# EAGLE design atxflip (EAGLE 7.2.0)
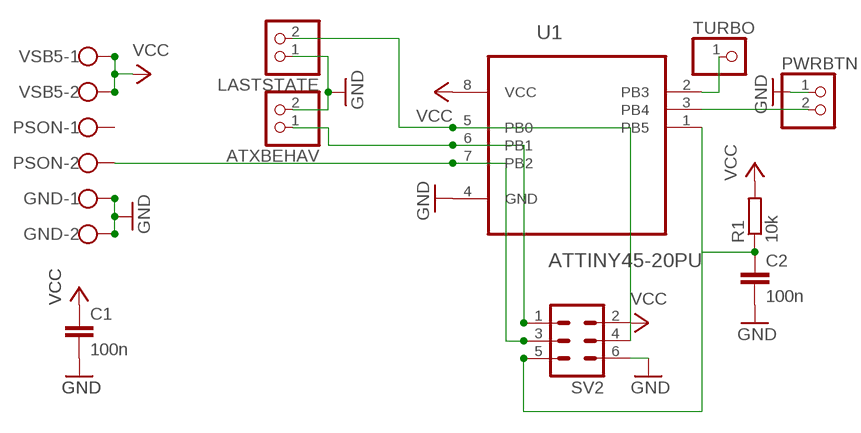
[diagram p0: schematic, sheet 1]

## Parts
ATXBEHAV  PINHD-1X2  [1X02]
C1  100n  C7.5/3  [C7.5B3]
C2  100n  C7.5/3  [C7.5B3]
GND  W237-102  [W237-102]
LASTSTATE  PINHD-1X2  [1X02]
PSON  W237-102  [W237-102]
PWRBTN  PINHD-1X2  [1X02]
R1  10k  R-EU_0207/10  [0207/10]
SV2  ML6  [ML6]
TURBO  PINHD-1X1  [1X01]
U1  ATTINY45-20PU  [DIP254P762X533-8]
VSB5  W237-102  [W237-102]

## Nets
GND: ATXBEHAV.2 C1.2 C2.2 GND.1 GND.2 LASTSTATE.1 PWRBTN.1 SV2.6 U1.4(GND)
N$1: PWRBTN.2 U1.3(PB4)
N$2: PSON.2 SV2.3 U1.7(PB2)
N$3: ATXBEHAV.1 SV2.1 U1.6(PB1)
N$4: LASTSTATE.2 SV2.4 U1.5(PB0)
N$5: TURBO.1 U1.2(PB3)
N$6: C2.1 R1.1 SV2.5 U1.1(PB5)
VCC: C1.1 R1.2 SV2.2 U1.8(VCC) VSB5.1 VSB5.2
Unconnected: PSON.1

## Library data of the parts
ATXBEHAV LASTSTATE PWRBTN = pinhead:PINHD-1X2: PIN HEADER
C1 C2 = capacitor-wima:C: CAPACITOR naming: grid - package width
GND PSON VSB5 = con-wago-500:W237-102: WAGO SCREW CLAMP; MPN: 237-102; OC_FARNELL: unknown; OC_NEWARK: 70K9898
R1 = resistor:R-EU_: RESISTOR, European symbol
SV2 = con-harting-ml:ML6: HARTING; OC_FARNELL: unknown; OC_NEWARK: unknown
TURBO = pinhead:PINHD-1X1: PIN HEADER
U1 = Atmel_By_element14_Batch_1-00:ATTINY45-20PU: 8-bit Microcontroller with 2/4/8KBytes In-System Programmable Flash; MPN: ATTINY45-20PU; OC_FARNELL: 1288352; OC_NEWARK: 23M5072; PACKAGE: PDIP-8; SUPPLIER: Atmel

## Board
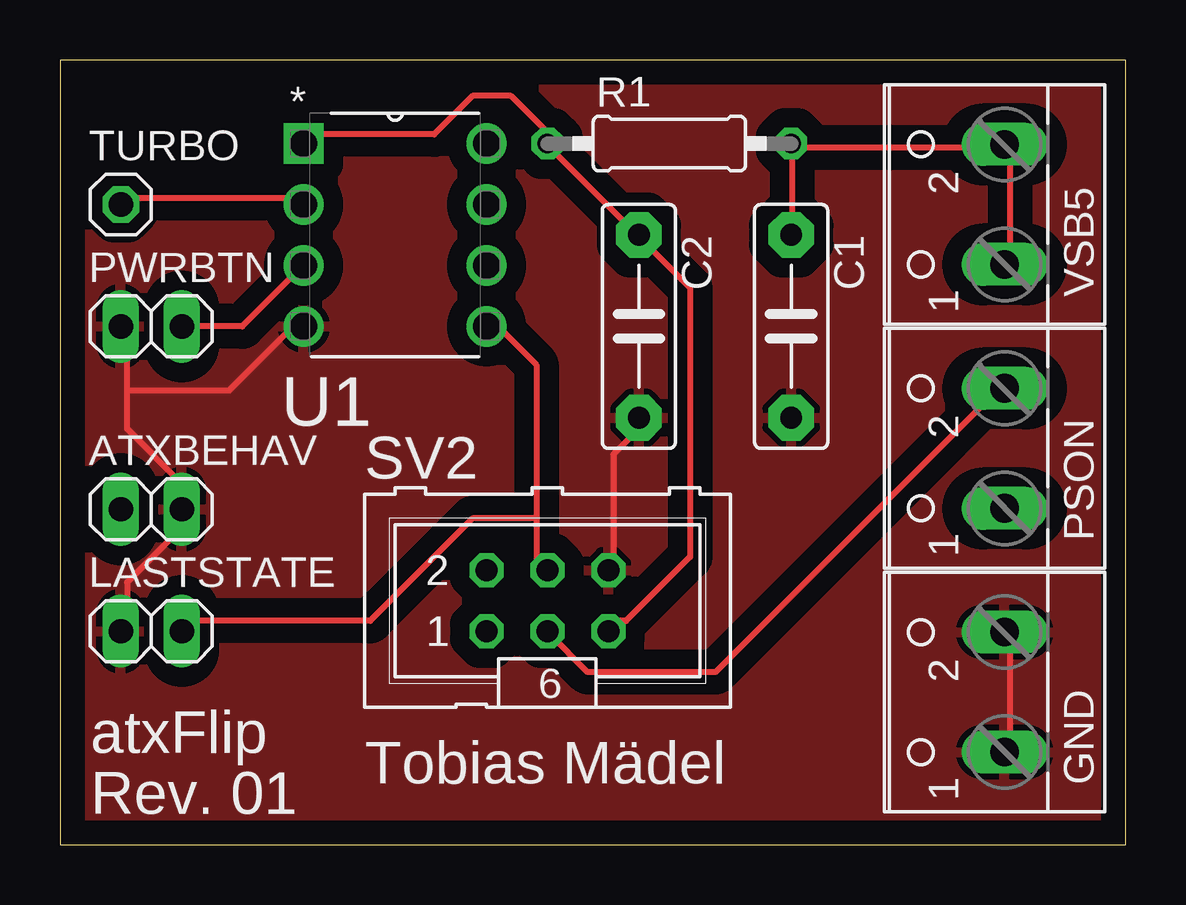
[diagram p1: board, top side]
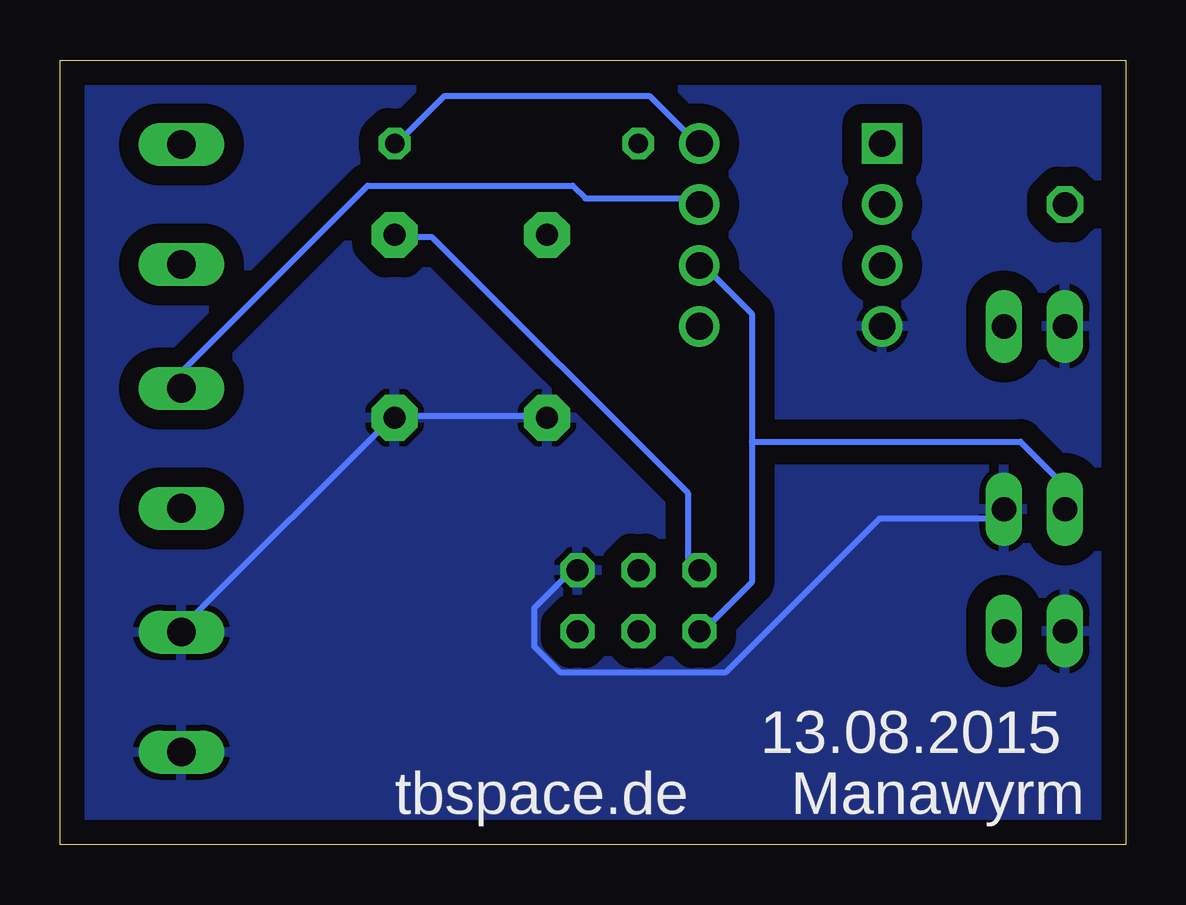
[diagram p2: board, bottom side, seen from below]

Size 44.43 x 32.69 mm. Coordinates in mm from the lower left corner, seen from the top.
Outline: 0,0 44.43,0 44.43,32.69 0,32.69 0,0
Copper layers (1*16): Top 0.035mm / dielectric 1.5mm / Bottom 0.035mm
Design rules "default *": minimum track width 10mil, minimum drill 32mil, track to track 32mil, track to pad 32mil, pad to pad 32mil, via to via 32mil, smd to smd 32mil, copper to edge 40mil, drill to drill 8mil, minimum pad ring 10mil, minimum via ring 8mil, stop-mask expansion 4mil, vias tented up to drill 0mil, thermal gap 10mil

### Footprints (pad centres in the part's own frame; a part is rotated, then mirrored left to right if it is on the bottom)
1X02 = drill 1.016 long: 1 -1.27,0; 2 1.27,0
C7.5B3 = drill 0.914 pad 1.905 octagon: 1 -3.81,0; 2 3.81,0
W237-102 = drill 1.194 long: 1 -2.5,-1.27; 2 2.5,-1.27
0207/10 = drill 0.813 octagon: 1 -5.08,0; 2 5.08,0
ML6 = drill 0.914 octagon: 1 -2.54,-1.27; 2 -2.54,1.27; 3 0,-1.27; 4 0,1.27; 5 2.54,-1.27; 6 2.54,1.27
1X01 = drill 1.016 octagon: 1 0,0
DIP254P762X533-8 = drill 1.118 square: 1 -7.62,7.62 | drill 1.118: 2 -7.62,5.08; 3 -7.62,2.54; 4 -7.62,0; 5 0,0; 6 0,2.54; 7 0,5.08; 8 0,7.62

### Placement (x,y rotation side)
ATXBEHAV  3.81,13.97 0 top
C1  30.48,21.59 270 top
C2  24.13,21.59 270 top
GND  38.1,6.35 90 top
LASTSTATE  3.81,8.89 0 top
PSON  38.1,16.51 90 top
PWRBTN  3.81,21.59 0 top
R1  25.4,29.21 0 top
SV2  20.32,10.16 0 top
TURBO  2.54,26.67 0 top
U1  17.78,21.59 0 top
VSB5  38.1,26.67 90 top

### Tracks (layer width: path | path; a pad name or v marks a point on that pad's centre or on a via)
GND
  Top 0.254: LASTSTATE.1 2.79,9.32 2.79,10.92 5.46,13.59 ATXBEHAV.2 4.93,14.12 4.93,15.19 2.79,17.32 2.79,18.92 | 2.79,18.92 2.79,21.59 PWRBTN.1 | 2.79,18.92 7.06,18.92 9.73,21.59 U1.4 | GND.1 39.6,3.99 39.6,8.79 GND.2 | SV2.6 23.06,11.46 23.06,16.26 24.13,17.32 C2.2
  Bottom 0.254: C2.2 24.13,17.86 30,17.86 C1.2 30.53,17.86 39.06,9.32 GND.2 | ATXBEHAV.2 5.46,13.59 10.26,13.59 16.66,7.19 23.6,7.19 24.66,8.26 24.66,9.86 23.06,11.46 SV2.6
  pour Top (isolate 0.254): 0,33.02 44.45,33.02 44.45,0 0,0
  pour Bottom (isolate 0.254): 0,33.02 44.45,33.02 44.45,0 0,0
N$1
  Top 0.254: PWRBTN.2 7.59,21.59 9.73,23.72 U1.3
N$2
  Top 0.254: SV2.3 20.4,8.79 22,7.19 27.33,7.19 39.06,18.92 PSON.2
  Bottom 0.254: U1.7 18.26,26.92 22.53,26.92 23.06,27.46 31.6,27.46 39.6,19.46 PSON.2
N$3
  Bottom 0.254: 15.6,16.79 15.6,22.12 17.73,24.26 U1.6 | 15.6,16.79 15.6,10.92 17.2,9.32 17.73,9.32 SV2.1 | 15.6,16.79 4.39,16.79 2.79,15.19 2.79,14.12 ATXBEHAV.1
N$4
  Top 0.254: 19.86,13.59 19.86,19.99 18.26,21.59 U1.5 | 19.86,13.59 19.86,11.46 SV2.4 | 19.86,13.59 17.2,13.59 12.93,9.32 5.46,9.32 LASTSTATE.2
N$5
  Top 0.254: TURBO.1 2.79,26.92 9.73,26.92 U1.2
N$6
  Top 0.254: 24.13,25.32 20.4,29.06 R1.1 20.4,29.59 18.8,31.19 17.2,31.19 15.6,29.59 10.26,29.59 U1.1 | 24.13,25.32 26.26,23.19 26.26,11.99 23.6,9.32 23.06,9.32 SV2.5 | 24.13,25.32 C2.1
VCC
  Top 0.254: VSB5.1 39.6,24.26 39.6,29.06 VSB5.2 39.06,29.06 30.53,29.06 | 30.53,29.06 30.53,25.86 C1.1 | 30.53,29.06 R1.2
  Bottom 0.254: SV2.2 18.26,11.46 18.26,14.66 28.93,25.32 30,25.32 C1.1 | U1.8 18.26,29.59 19.86,31.19 28.4,31.19 30,29.59 R1.2

### Text on the board
tPlace: atxFlip | Tobias Mädel | Rev. 01
bPlace: 13.08.2015 | Manawyrm | tbspace.de